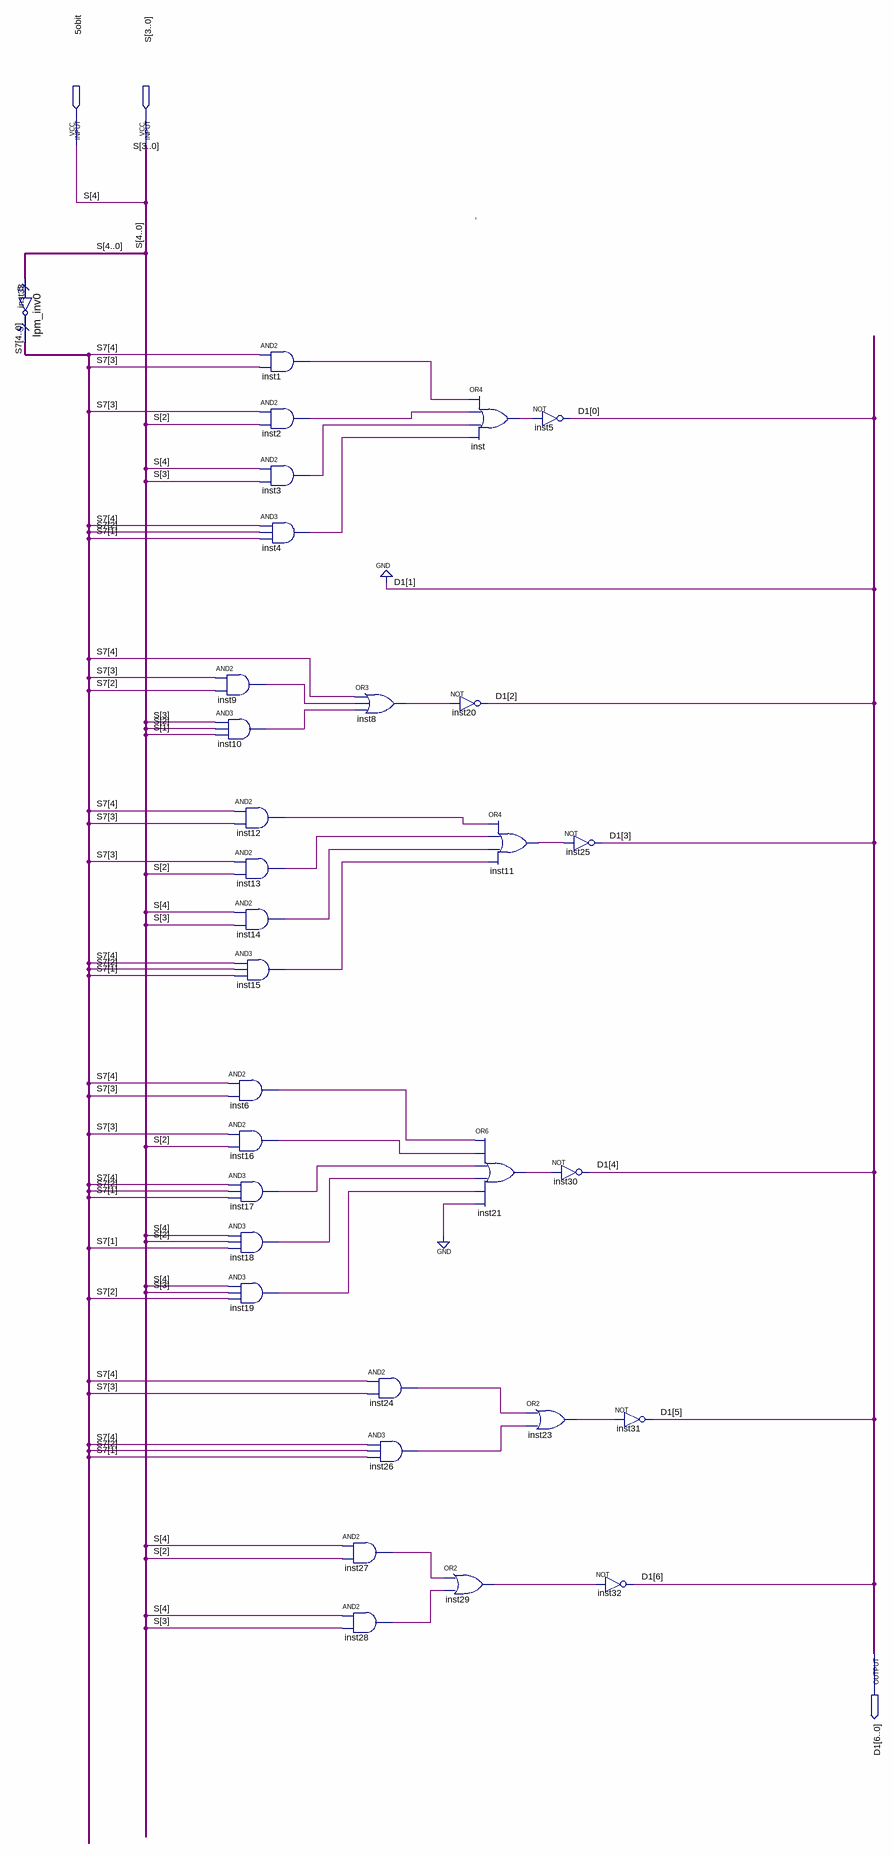
[diagram p0: schematic sheet]
// Quartus schematic displayEsquerda.bdf as structural Verilog: 32 symbols, 3 pins
module displayEsquerda (
  input  \5obit ,
  input  [3:0] S,
  output [6:0] D1
);

  wire inst1_out, inst2_out, inst3_out, inst4_out, inst6_out, inst8_out, inst9_out, inst10_out, inst11_out,
       inst12_out, inst13_out, inst14_out, inst15_out, inst16_out, inst17_out, inst18_out, inst19_out,
       inst21_out, inst23_out, inst24_out, inst26_out, inst27_out, inst28_out, inst29_out, inst_out;
  wire [4:0] S7;

  lpm_inv0 inst33 (.data({\5obit , S}), .result(S7));
  and inst1 (inst1_out, S7[4], S7[3]);
  and inst2 (inst2_out, S7[3], S[2]);
  and inst3 (inst3_out, \5obit , S[3]);
  and inst4 (inst4_out, S7[4], S7[2], S7[1]);
  and inst9 (inst9_out, S7[3], S7[2]);
  and inst10 (inst10_out, S[3], S[2], S[1]);
  and inst12 (inst12_out, S7[4], S7[3]);
  and inst13 (inst13_out, S7[3], S[2]);
  and inst14 (inst14_out, \5obit , S[3]);
  and inst15 (inst15_out, S7[4], S7[2], S7[1]);
  and inst6 (inst6_out, S7[4], S7[3]);
  and inst16 (inst16_out, S7[3], S[2]);
  and inst17 (inst17_out, S7[4], S7[2], S7[1]);
  and inst18 (inst18_out, \5obit , S[2], S7[1]);
  and inst19 (inst19_out, \5obit , S[3], S7[2]);
  or inst8 (inst8_out, S7[4], inst9_out, inst10_out);
  and inst27 (inst27_out, \5obit , S[2]);
  and inst28 (inst28_out, \5obit , S[3]);
  and inst24 (inst24_out, S7[4], S7[3]);
  and inst26 (inst26_out, S7[4], S7[2], S7[1]);
  not inst20 (D1[2], inst8_out);
  or inst29 (inst29_out, inst27_out, inst28_out);
  or inst (inst_out, inst1_out, inst2_out, inst3_out, inst4_out);
  or inst11 (inst11_out, inst12_out, inst13_out, inst14_out, inst15_out);
  or inst21 (inst21_out, inst6_out, inst16_out, inst17_out, inst18_out, inst19_out, 1'b0);
  not inst5 (D1[0], inst_out);
  not inst25 (D1[3], inst11_out);
  not inst30 (D1[4], inst21_out);
  or inst23 (inst23_out, inst24_out, inst26_out);
  not inst31 (D1[5], inst23_out);
  not inst32 (D1[6], inst29_out);

  assign D1[1] = 1'b0;

  // Other names for the same wires on the sheet: S[4] = \5obit 

  // Notes on the sheet:
  //   '
endmodule
